# Altium schematic sheet USB3_Controller_Schematics.SchDoc
size A
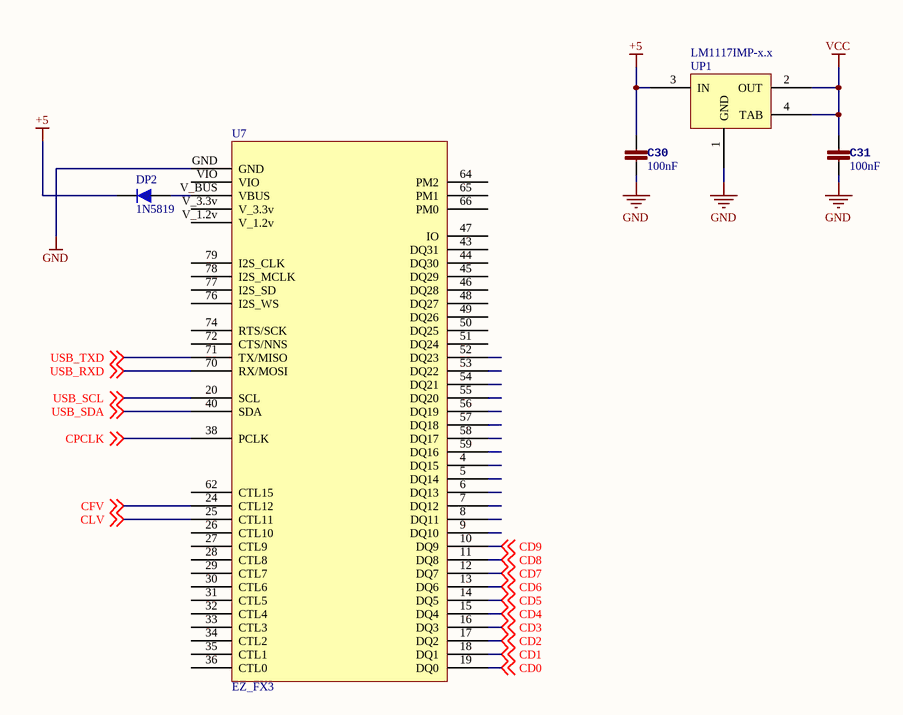
[diagram p0: USB3_Controller_Schematics.SchDoc]

## Parts
C30  value 100nF  [_0805]  (hidden comment: Cap)
C31  value 100nF  [_0805]  (hidden comment: Cap)
DP2  1N5819  [430X270D]
U7  EZ_FX3  [EZ_FX3]
UP1  LM1117IMP-x.x  [SOT223_4]

## Nets
+5: C30.1 DP2.2 UP1.3(IN)
GND: C30.2 C31.2 U7.GND UP1.1(GND)
VCC: C31.1 UP1.2(OUT) UP1.4(TAB)
CD0: U7.19(DQ0) ; off-sheet CD0
CD1: U7.18(DQ1) ; off-sheet CD1
CD2: U7.17(DQ2) ; off-sheet CD2
CD3: U7.16(DQ3) ; off-sheet CD3
CD4: U7.15(DQ4) ; off-sheet CD4
CD5: U7.14(DQ5) ; off-sheet CD5
CD6: U7.13(DQ6) ; off-sheet CD6
CD7: U7.12(DQ7) ; off-sheet CD7
CD8: U7.11(DQ8) ; off-sheet CD8
CD9: U7.10(DQ9) ; off-sheet CD9
CFV: U7.24(CTL12) ; off-sheet CFV
CLV: U7.25(CTL11) ; off-sheet CLV
CPCLK: U7.38(PCLK) ; off-sheet CPCLK
USB_RXD: U7.70(RX/MOSI) ; off-sheet USB_RXD
USB_SCL: U7.20(SCL) ; off-sheet USB_SCL
USB_SDA: U7.40(SDA) ; off-sheet USB_SDA
USB_TXD: U7.71(TX/MISO) ; off-sheet USB_TXD
NetDP2_1: DP2.1 U7.V_BUS(VBUS)

Not connected (* = marked no-connect by the designer): U7 4(DQ15) 5(DQ14) 6(DQ13) 7(DQ12) 8(DQ11) 9(DQ10) 26(CTL10) 27(CTL9) 28(CTL8) 29(CTL7) 30(CTL6) 31(CTL5) 32(CTL4) 33(CTL3) 34(CTL2) 35(CTL1) 36(CTL0) 43(DQ31) 44(DQ30) 45(DQ29) 46(DQ28) 47(IO) 48(DQ27) 49(DQ26) 50(DQ25) 51(DQ24) 52(DQ23) 53(DQ22) 54(DQ21) 55(DQ20) 56(DQ19) 57(DQ18) 58(DQ17) 59(DQ16) 62(CTL15) 64(PM2) 65(PM1) 66(PM0) 72(CTS/NNS) 74(RTS/SCK) 76(I2S_WS) 77(I2S_SD) 78(I2S_MCLK) 79(I2S_CLK) V_1.2v V_3.3v VIO

## Library data of the parts
C30 C31 = Cap_1
DP2 = 1N5819: Schottkey Rectifiers; Designer: Abbas Basereh; Data: 16-12-2016; Link: *; Part. No: *
UP1 = LM1117IMP-x.x: x.x Volt, 800mA Low-Dropout Linear Regulator, 4-pin SOT-223; Designer: Abbas Basereh; Data: 16-12-2016; VALUE: LM1117IMP-x.x